# Altium schematic sheet pico_camera.SchDoc
size A4; Date: 2023.12.01; Author: lichuang
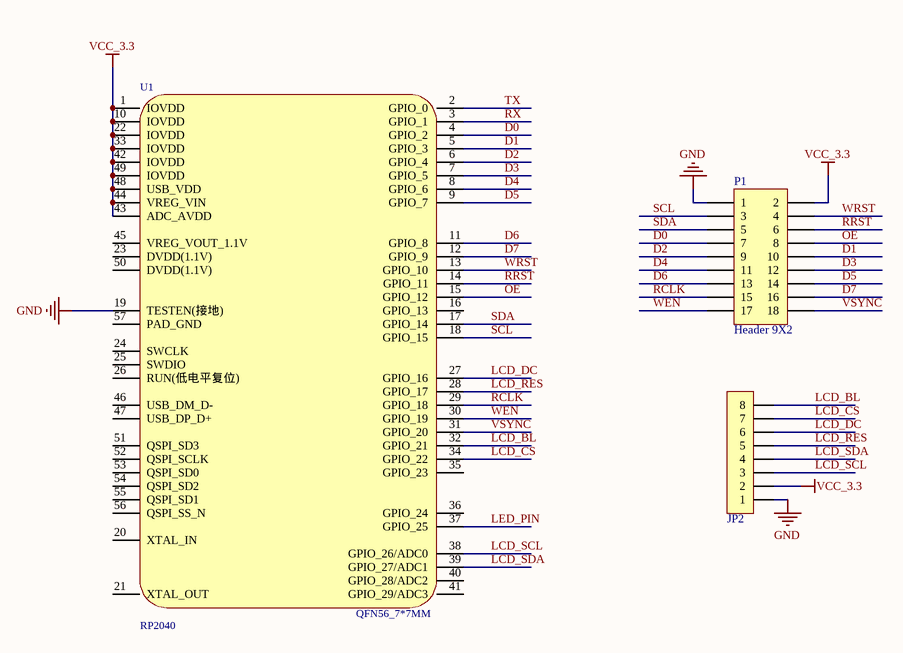
[diagram p0: pico_camera.SchDoc]

## Parts
JP2  HDR-1X8  [XH2.54-WI-8P]  (value not drawn)
P1  Header 9X2  [HDR2X9]
U1  QFN56_7*7MM  [QFN_56_7*7MM]  (value not drawn)

## Nets
GND: JP2.1 P1.1 U1.19(TESTEN(接地))
VCC_3.3: JP2.2 P1.2 U1.1(IOVDD) U1.10(IOVDD) U1.22(IOVDD) U1.33(IOVDD) U1.42(IOVDD) U1.43(ADC_AVDD) U1.44(VREG_VIN) U1.48(USB_VDD) U1.49(IOVDD)
D0: P1.7 U1.4(GPIO_2)
D1: P1.10 U1.5(GPIO_3)
D2: P1.9 U1.6(GPIO_4)
D3: P1.12 U1.7(GPIO_5)
D4: P1.11 U1.8(GPIO_6)
D5: P1.14 U1.9(GPIO_7)
D6: P1.13 U1.11(GPIO_8)
D7: P1.16 U1.12(GPIO_9)
LCD_BL: JP2.8 U1.32(GPIO_21)
LCD_CS: JP2.7 U1.34(GPIO_22)
LCD_DC: JP2.6 U1.27(GPIO_16)
LCD_RES: JP2.5 U1.28(GPIO_17)
LCD_SCL: JP2.3 U1.38(GPIO_26/ADC0)
LCD_SDA: JP2.4 U1.39(GPIO_27/ADC1)
LED_PIN: U1.37(GPIO_25)
OE: P1.8 U1.15(GPIO_12)
RCLK: P1.15 U1.29(GPIO_18)
RRST: P1.6 U1.14(GPIO_11)
RX: U1.3(GPIO_1)
SCL: P1.3 U1.18(GPIO_15)
SDA: P1.5 U1.17(GPIO_14)
TX: U1.2(GPIO_0)
VSYNC: P1.18 U1.31(GPIO_20)
WEN: P1.17 U1.30(GPIO_19)
WRST: P1.4 U1.13(GPIO_10)

Not connected (* = marked no-connect by the designer): U1 16(GPIO_13) 20(XTAL_IN) 21(XTAL_OUT) 23(DVDD(1.1V)) 24(SWCLK) 25(SWDIO) 26(RUN(低电平复位)) 35(GPIO_23) 36(GPIO_24) 40(GPIO_28/ADC2) 41(GPIO_29/ADC3) 45(VREG_VOUT_1.1V) 46(USB_DM_D-) 47(USB_DP_D+) 50(DVDD(1.1V)) 51(QSPI_SD3) 52(QSPI_SCLK) 53(QSPI_SD0) 54(QSPI_SD2) 55(QSPI_SD1) 56(QSPI_SS_N) 57(PAD_GND)

## Library data of the parts
JP2 = Header 8: 8P接插件; 版权归属: 封装库来自淘宝 ID：黄晶宝石; BOM名称: 8P接插件; 学习资源: https://shop463601444.taobao.com
P1 = Header 9X2: Header, 9-Pin, Dual row; LatestRevisionDate: 17-Jul-2002; LatestRevisionNote: Re-released for DXP Platform.; Publisher: Altium Limited
U1 = RP2040: Comment_1: RP2040